# Altium project Flyback_lab_supply.PrjPcb
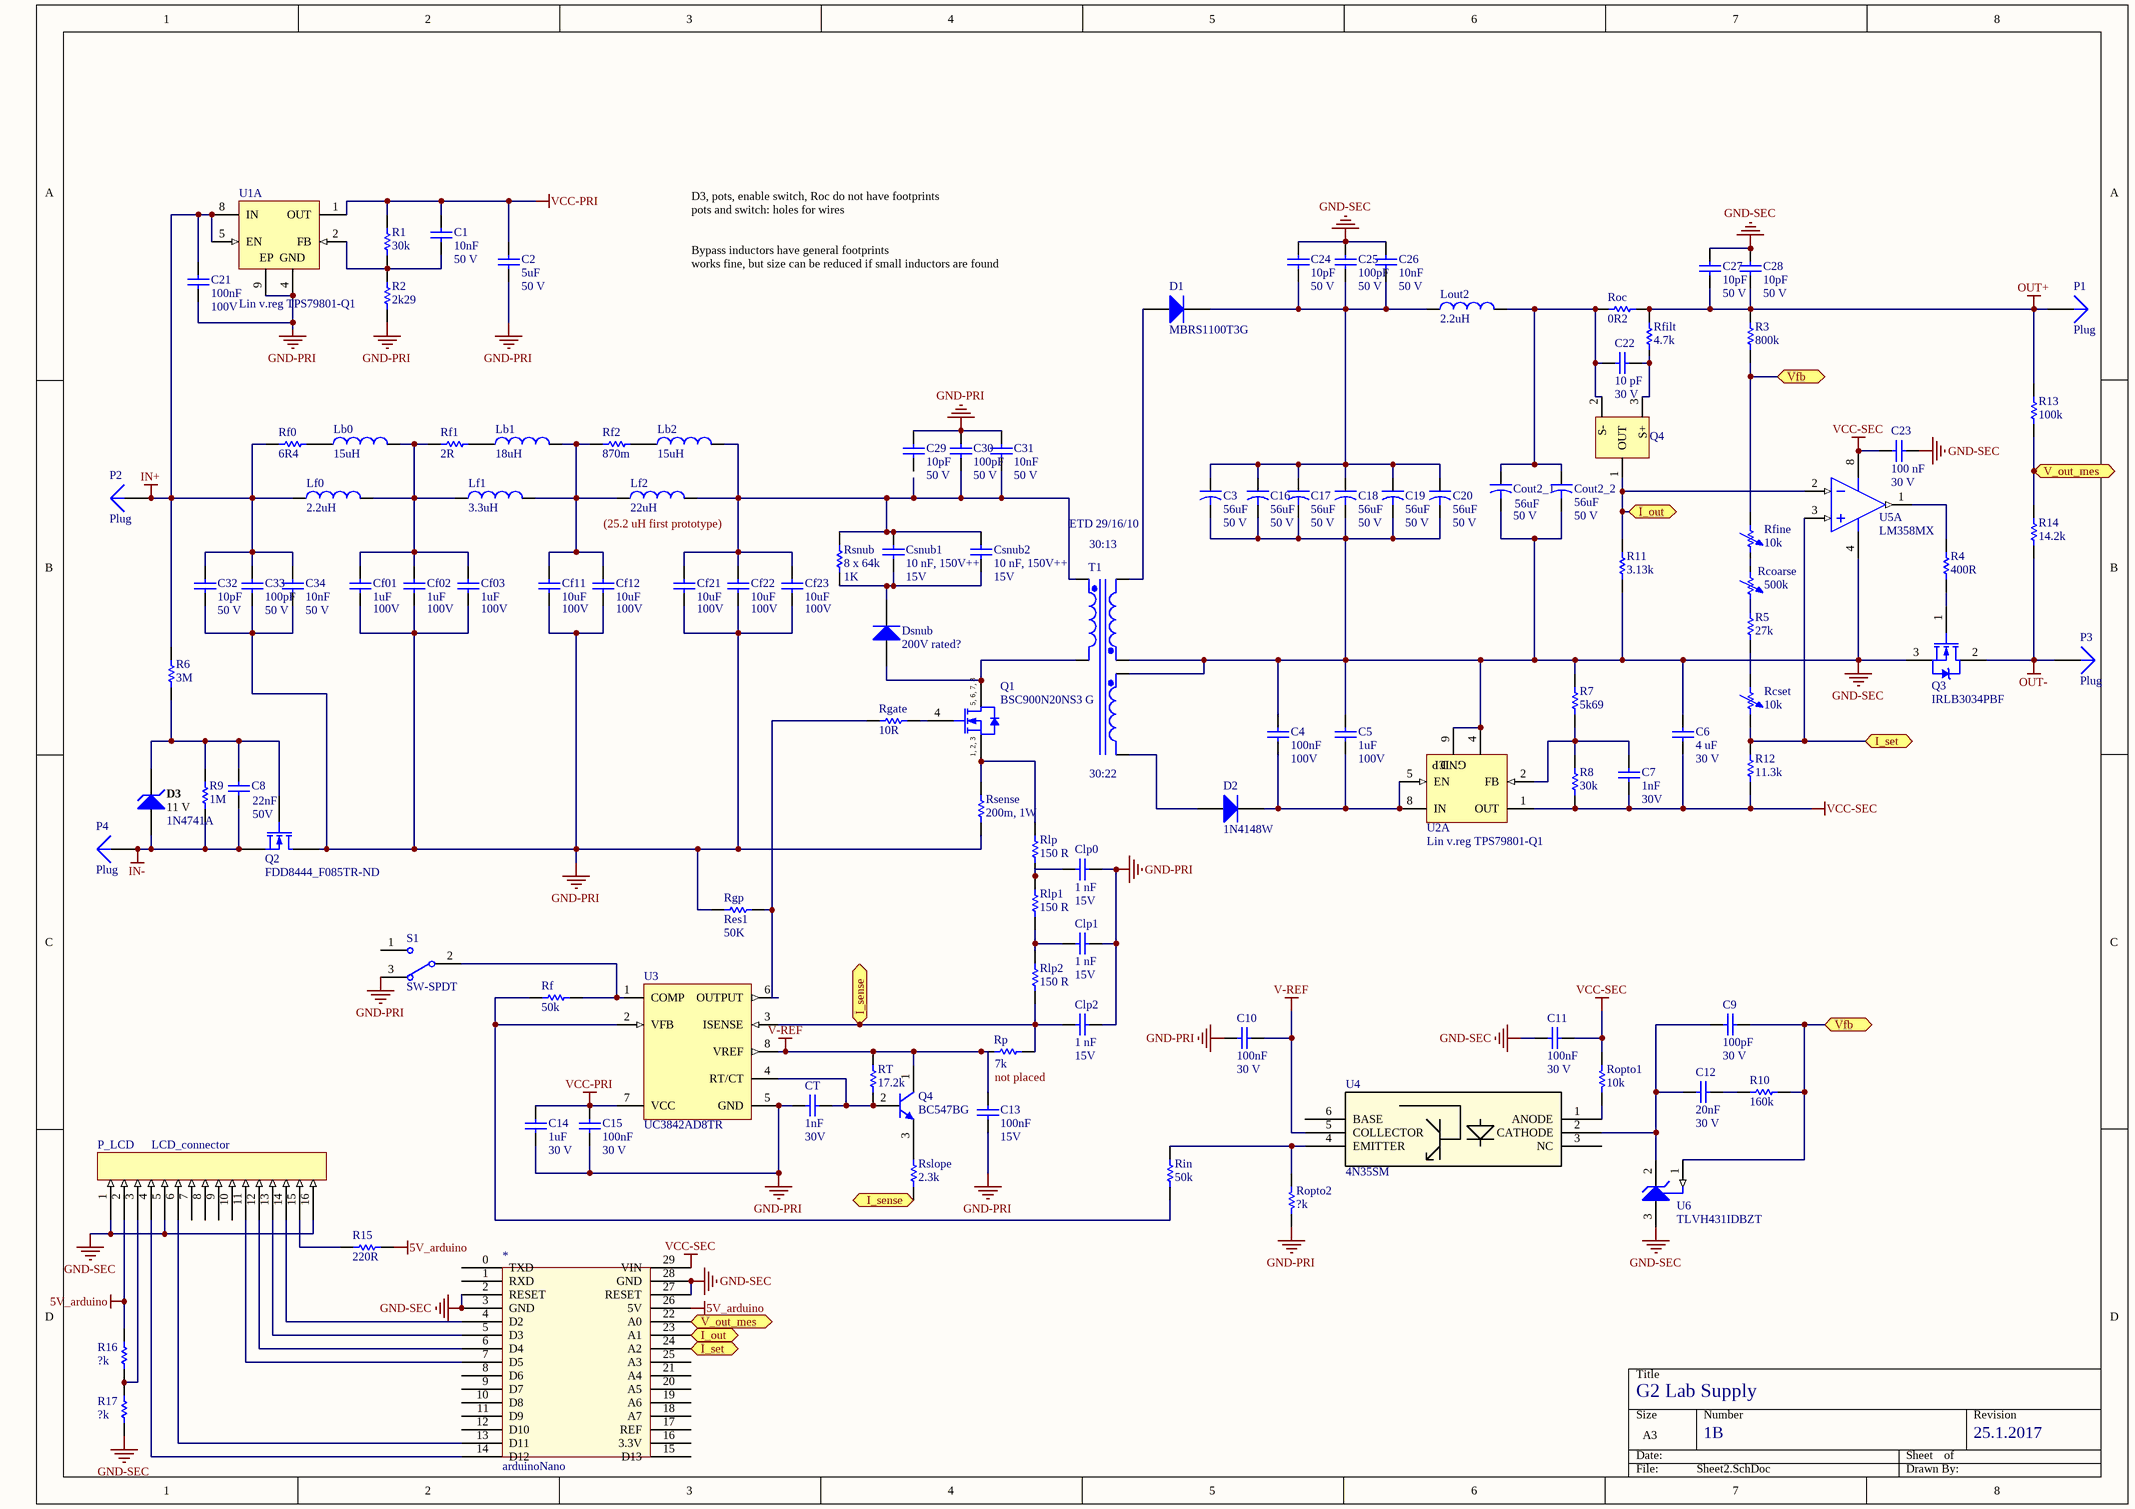
[diagram p0: Sheet2.SchDoc]
1 sheet, 119 parts. Net scope: flat (ports and power ports of the same name join across sheets).
Board file: PCB2.PcbDoc

## Sheet Sheet2.SchDoc: G2 Lab Supply
size A3; Revision: 1B

### Parts
(Parts that share a designator on the sheet are numbered #1, #2 ... from top to bottom, then left to right.)
*  arduinoNano  [Arduino nano]
C1  10nF  Rated Voltage: 50 V  [CAPC0805(2012)145_N]
C2  5uF  Rated Voltage: 50 V  [CAPC0805(2012)145_N]
C3  value 56uF  Voltage - Rated: 50 V  [Panasonic 56uF 50V EEU-FM1H560]  (hidden comment: Panasonic EEU-FM1H560)
C4  100nF  Rated Voltage: 100V  [CAPC0805(2012)145_N]
C5  1uF  Voltage - Rated: 100V  [CAPC3216X180X20LL20]
C6  4 uF  Rated Voltage: 30 V  [CAPC0805(2012)145_N]
C7  1nF  Rated Voltage: 30V  [CAPC0805(2012)145_N]
C8  22nF  Rated Voltage: 50V  [CAPC0805(2012)145_N]
C9  100pF  Rated Voltage: 30 V  [CAPC0805(2012)145_N]
C10  100nF  Rated Voltage: 30 V  [CAPC0805(2012)145_N]
C11  100nF  Rated Voltage: 30 V  [CAPC0805(2012)145_N]
C12  20nF  Rated Voltage: 30 V  [CAPC0805(2012)145_N]
C13  100nF  Rated Voltage: 15V  [CAPC0805(2012)145_N]
C14  1uF  Rated Voltage: 30 V  [CAPC0805(2012)145_N]
C15  100nF  Rated Voltage: 30 V  [CAPC0805(2012)145_N]
C16  value 56uF  Voltage - Rated: 50 V  [Panasonic 56uF 50V EEU-FM1H560]  (hidden comment: Panasonic EEU-FM1H560)
C17  value 56uF  Voltage - Rated: 50 V  [Panasonic 56uF 50V EEU-FM1H560]  (hidden comment: Panasonic EEU-FM1H560)
C18  value 56uF  Voltage - Rated: 50 V  [Panasonic 56uF 50V EEU-FM1H560]  (hidden comment: Panasonic EEU-FM1H560)
C19  value 56uF  Voltage - Rated: 50 V  [Panasonic 56uF 50V EEU-FM1H560]  (hidden comment: Panasonic EEU-FM1H560)
C20  value 56uF  Voltage - Rated: 50 V  [Panasonic 56uF 50V EEU-FM1H560]  (hidden comment: Panasonic EEU-FM1H560)
C21  100nF  Rated Voltage: 100V  [CAPC0805(2012)145_N]
C22  10 pF  Rated Voltage: 30 V  [CAPC0805(2012)145_N]
C23  100 nF  Rated Voltage: 30 V  [CAPC0805(2012)145_N]
C24  10pF  Rated Voltage: 50 V  [CAPC0805(2012)145_N]
C25  100pF  Rated Voltage: 50 V  [CAPC0805(2012)145_N]
C26  10nF  Rated Voltage: 50 V  [CAPC0805(2012)145_N]
C27  10pF  Rated Voltage: 50 V  [CAPC0805(2012)145_N]
C28  10pF  Rated Voltage: 50 V  [CAPC0805(2012)145_N]
C29  10pF  Rated Voltage: 50 V  [CAPC0805(2012)145_N]
C30  100pF  Rated Voltage: 50 V  [CAPC0805(2012)145_N]
C31  10nF  Rated Voltage: 50 V  [CAPC0805(2012)145_N]
C32  10pF  Rated Voltage: 50 V  [CAPC0805(2012)145_N]
C33  100pF  Rated Voltage: 50 V  [CAPC0805(2012)145_N]
C34  10nF  Rated Voltage: 50 V  [CAPC0805(2012)145_N]
Cf01  1uF  Voltage - Rated: 100V  [CAPC3216X180X20LL20]
Cf02  1uF  Voltage - Rated: 100V  [CAPC3216X180X20LL20]
Cf03  1uF  Voltage - Rated: 100V  [CAPC3216X180X20LL20]
Cf11  10uF  Voltage - Rated: 100V  [CAPC5750X250X20LL40]
Cf12  10uF  Voltage - Rated: 100V  [CAPC5750X250X20LL40]
Cf21  10uF  Voltage - Rated: 100V  [CAPC5750X250X20LL40]
Cf22  10uF  Voltage - Rated: 100V  [CAPC5750X250X20LL40]
Cf23  10uF  Voltage - Rated: 100V  [CAPC5750X250X20LL40]
Clp0  1 nF  Rated Voltage: 15V  [CAPC0805(2012)145_N]
Clp1  1 nF  Rated Voltage: 15V  [CAPC0805(2012)145_N]
Clp2  1 nF  Rated Voltage: 15V  [CAPC0805(2012)145_N]
Cout2_1  value 56uF  Voltage - Rated: 50 V  [Panasonic 56uF 50V EEU-FM1H560]  (hidden comment: Panasonic EEU-FM1H560)
Cout2_2  value 56uF  Voltage - Rated: 50 V  [Panasonic 56uF 50V EEU-FM1H560]  (hidden comment: Panasonic EEU-FM1H560)
Csnub1  10 nF, 150V++  Rated Voltage: 15V  [CAPC0805(2012)145_N]
Csnub2  10 nF, 150V++  Rated Voltage: 15V  [CAPC0805(2012)145_N]
CT  1nF  Rated Voltage: 30V  [CAPC0805(2012)145_N]
D1  MBRS1100T3G  [SMC]
D2  1N4148W  [JSCJ-SOD-123-2_V]
D3  11 V  PartNumber: 1N4741A  [FAIR-DO-41-2_V]
Dsnub  200V rated?  [SMC]
Lb0  15uH  [Lb low current inductor]
Lb1  18uH  [Lb low current inductor]
Lb2  15uH  [Lb low current inductor]
Lf0  2.2uH  [Wurth 744316220]
Lf1  3.3uH  [Wurth 7443340330]
Lf2  22uH  [Bourns PM5022S-220M-RC]
Lout2  2.2uH  [Wurth 744316220]
P1  Plug  [input output connector]
P2  Plug  [input output connector]
P3  Plug  [input output connector]
P4  Plug  [input output connector]
P_LCD  LCD_connector  [16-pin]
Q1  BSC900N20NS3 G  [INF-PG-TDSON-8-1_V]
Q2  FDD8444_F085TR-ND  [FDD8444]
Q3  IRLB3034PBF  [INF-PG-TO-220AB]
Q4#1  Current sense amplifier  [ZXCT1107S]  (value not drawn)
Q4#2  BC547BG  [ONSC-TO-92-3-29-11]
R1  30k  [RESC0805(2012)_L]
R2  2k29  [RESC0805(2012)_L]
R3  800k  [RESC0805(2012)_L]
R4  400R  [RESC0805(2012)_L]
R5  27k  [RESC0805(2012)_L]
R6  3M  [RESC0805(2012)_L]
R7  5k69  [RESC0805(2012)_L]
R8  30k  [RESC0805(2012)_L]
R9  1M  [RESC0805(2012)_L]
R10  160k  [RESC0805(2012)_L]
R11  3.13k  [RESC0805(2012)_L]
R12  11.3k  [RESC0805(2012)_L]
R13  100k  [RESC0805(2012)_L]
R14  14.2k  [RESC0805(2012)_L]
R15  value 220R  [RESC0805(2012)_L]
R16  value ?k  [RESC0805(2012)_L]
R17  value ?k  [RESC0805(2012)_L]
Rcoarse  500k  [AXIAL-0.7]
Rcset  10k  [AXIAL-0.7]
Rf  50k  [RESC0805(2012)_L]
Rf0  6R4  [RESC0805(2012)_L]
Rf1  2R  [RESC0805(2012)_L]
Rf2  870m  [RESC0805(2012)_L]
Rfilt  4.7k  [RESC0805(2012)_L]
Rfine  10k  [AXIAL-0.7]
Rgate  10R  [RESC0805(2012)_L]
Rgp  Res1  value 50K  [6-0805_L]
Rin  50k  [RESC0805(2012)_L]
Rlp  150 R  [RESC0805(2012)_L]
Rlp1  150 R  [RESC0805(2012)_L]
Rlp2  150 R  [RESC0805(2012)_L]
Roc  0R2  [RESC0805(2012)_L]
Ropto1  10k  [RESC0805(2012)_L]
Ropto2  ?k  [RESC0805(2012)_L]
Rp  not placed  value 7k  [RESC0805(2012)_L]
Rsense  200m, 1W  [RESC2512(6432)_M]
Rslope  value 2.3k  [RESC0805(2012)_L]
Rsnub  8 x 64k  value 1K  [Resistor snubber]
RT  17.2k  [RESC0805(2012)_L]
S1  SW-SPDT  [TL36WW15050]
T1  ETD 29/16/10, Turns ratio 30:13:22  [ETD 29/16/10 v2]  (value not drawn)
U1  Lin v.reg TPS79801-Q1  [DGN0008B_N]  (part A of 2)
U2  Lin v.reg TPS79801-Q1  [DGN0008B_N]  (part A of 2)
U3  UC3842AD8TR  [D0008A_L]
U4  4N35SM  [4N35SM (RS 917-5447)]
U5  LM358MX  [D0008A_M]  (part A of 2)
U6  TLVH431IDBZT  [TI-DBZ3_N]

### Ports
I_out, I_sense, I_set, V_out_mes, Vfb

### Nets
5V_arduino: *.26(5V) P_LCD.2 R15.1 R16.2
GND-PRI: C2.1 C10.1 C13.2 C14.1 C15.1 C21.1 C29.2 C30.2 C31.2 C32.1 C33.1 C34.1 Cf01.1 Cf02.1 Cf03.1 Cf11.1 Cf12.1 Cf21.1 Cf22.1 Cf23.1 Clp0.2 Clp1.2 Clp2.2 CT.2 Q2.1(D) R2.1 Rgp.2 Ropto2.1 Rsense.1 S1.3 U1.4(GND) U1.9(EP) U3.5(GND)
GND-SEC: *.2(RESET) *.3(GND) *.27(RESET) *.28(GND) C3.2 C4.2 C5.2 C6.2 C11.1 C16.2 C17.2 C18.2 C19.2 C20.2 C23.1 C24.2 C25.2 C26.2 C27.2 C28.2 Cout2_1.2 Cout2_2.2 P_LCD.1 P_LCD.5 P_LCD.16 Q3.3(S) R7.1 R11.1 R17.1 T1.3(Sec1+) T1.5(Sec2+) U2.4(GND) U2.9(EP) U5.4(GND) U6.3(ANODE)
IN+: C21.2 C32.2 C33.2 C34.2 Lf0.1 P2.1 R6.2 Rf0.2 U1.5(EN) U1.8(IN)
IN-: C8.1 D3.1(A) P4.1 Q2.3(S) R9.1
OUT+: C27.1 C28.1 P1.1 R3.2 R13.2 Rfilt.2 Roc.2
OUT-: P3.1 Q3.2(D) R14.1
V-REF: C10.2 C13.1 Q4#2.1(C) Rp.1 RT.2 U3.8(VREF) U4.5(COLLECTOR)
VCC-PRI: C1.2 C2.2 C14.2 C15.2 R1.2 U1.1(OUT) U3.7(VCC)
VCC-SEC: *.29(VIN) C6.1 C7.1 C11.2 C23.2 R8.2 R12.2 Ropto1.1 U2.1(OUT) U5.8(V+)
Net*_4: *.4(D2) P_LCD.14
Net*_5: *.5(D3) P_LCD.13
Net*_6: *.6(D4) P_LCD.12
Net*_7: *.7(D5) P_LCD.11
Net*_13: *.13(D11) P_LCD.6
Net*_14: *.14(D12) P_LCD.4
Net*_22: *.22(A0) R13.1 R14.2 ; port V_out_mes
Net*_23: *.23(A1) Q4#1.1(OUT) R11.2 U5.2(INA-) ; port I_out
Net*_24: *.24(A2) R12.1 Rcset.2 U5.3(INA+) ; port I_set
NetC1_1: C1.1 R1.1 R2.2 U1.2(FB)
NetC3_1: C3.1 C16.1 C17.1 C18.1 C19.1 C20.1 C24.1 C25.1 C26.1 D1.2(K) Lout2.1
NetC4_1: C4.1 C5.1 D2.2(-) U2.5(EN) U2.8(IN)
NetC7_2: C7.2 R7.2 R8.1 U2.2(FB)
NetC8_2: C8.2 D3.2(K) Q2.2(G) R6.1 R9.2
NetC9_1: C9.1 C12.1 U4.2(CATHODE) U6.2(CATHODE)
NetC9_2: C9.2 R3.1 R10.1 Rfine.1 U6.1(REF) ; port Vfb
NetC12_2: C12.2 R10.2
NetC22_1: C22.1 Q4#1.3(S+) Rfilt.1
NetC22_2: C22.2 Cout2_1.1 Cout2_2.1 Lout2.2 Q4#1.2(S-) Roc.1
NetC30_1: C30.1 C31.1 Cf21.2 Cf22.2 Cf23.2 Csnub1.2 Csnub2.2 Lb2.2 Lf2.2 Rsnub.2 T1.1(Pri+)
NetCf01_2: Cf01.2 Cf02.2 Cf03.2 Lb0.2 Lf0.2 Lf1.1 Rf1.2
NetCf11_2: Cf11.2 Cf12.2 Lb1.2 Lf1.2 Lf2.1 Rf2.2
NetClp0_1: Clp0.1 Rlp.2 Rlp1.1
NetClp1_1: Clp1.1 Rlp1.2 Rlp2.1
NetClp2_1: Clp2.1 Rlp2.2 Rp.2 Rslope.1 U3.3(ISENSE) ; port I_sense
NetCsnub1_1: Csnub1.1 Csnub2.1 Dsnub.2(K) Rsnub.1
NetCT_1: CT.1 Q4#2.2(B) RT.1 U3.4(RT/CT)
NetD1_1: D1.1(A) T1.4(Sec1-)
NetD2_1: D2.1(+) T1.6(Sec2-)
NetDsnub_1: Dsnub.1(A) Q1.5(DRAIN) Q1.6(DRAIN) Q1.7(DRAIN) Q1.8(DRAIN) T1.2(Pri-)
NetLb0_1: Lb0.1 Rf0.1
NetLb1_1: Lb1.1 Rf1.1
NetLb2_1: Lb2.1 Rf2.1
NetP_LCD_3: P_LCD.3 R16.1 R17.2
NetP_LCD_15: P_LCD.15 R15.2
NetQ1_1: Q1.1(SOURCE) Q1.2(SOURCE) Q1.3(SOURCE) Rlp.1 Rsense.2
NetQ1_4: Q1.4(GATE) Rgate.1
NetQ3_1: Q3.1(G) R4.1
NetQ4#2_3: Q4#2.3(E) Rslope.2
NetR4_2: R4.2 U5.1(OUTA)
NetR5_1: R5.1 Rcset.1
NetR5_2: R5.2 Rcoarse.2
NetRcoarse_1: Rcoarse.1 Rfine.2
NetRf_1: Rf.1 S1.2 U3.1(COMP)
NetRf_2: Rf.2 Rin.2 U3.2(VFB)
NetRgate_2: Rgate.2 Rgp.1 U3.6(OUTPUT)
NetRin_1: Rin.1 Ropto2.2 U4.4(EMITTER)
NetRopto1_2: Ropto1.2 U4.1(ANODE)

Not connected (* = marked no-connect by the designer): * 0(TXD) 1(RXD) 8(D6) 9(D7) 10(D8) 11(D9) 12(D10) 15(D13) 16(3.3V) 17(REF) 18(A7) 19(A6) 20(A5) 21(A4) 25(A3); C29 1; P_LCD 7 8 9 10; S1 1; U4 3(NC) 6(BASE)

### Notes on the sheet
- D3, pots, enable switch, Roc do not have footprints
  pots and switch: holes for wires
  Bypass inductors have general footprints
  works fine, but size can be reduced if small inductors are found
- (near Lf2) (25.2 uH first prototype)
- ETD 29/16/10
- (near T1) 30:13
- (near T1) 30:22
- 25.1.2017
- (in symbol CMP-1091-00024-1) 5, 6, 7, 8; 1, 2, 3

### Library data of the parts
C1 C2 C6-C15 C22-C34 Clp0-Clp2 Csnub1 Csnub2 CT = CMP-1036-04379-1: CAP 82nF; Case-EIA: 0805; Case-Metric: 2012; Tolerance: Â±10%; Value: 82nF; Technology: SMT; Max Thickness: 1.45 mm
C3 = Cap2: Published: 23-Sep-2002; PackageReference: CAPR5-4X5; Publisher: Altium Limited; PackageDescription: Capacitor; 2 Leads
C4 C21 = CMP-1036-04379-1: footprint not correct; Value: 82nF; Case-EIA: 0805; Case-Metric: 2012; Tolerance: Â±10%; Technology: SMT; Max Thickness: 1.45 mm
C5 Cf01 Cf02 Cf03 = CMP-2000-06049-1: Chip Capacitor, 1 uF, +/- 10%, 100 V, -55 to 125 degC, 1206 (3216 Metric), RoHS, Tape and Reel; Manufacturer: TDK; PCN Part Number: MLCCPartNumberChange30/Nov/2012; Kits: SAMPLEKIT1008-ND-KITCAPCERMLCC100V-630V; Product Training Modules: SEAT,CCV,andTVCLDesignToolsGuidetoReplacinganElectrolyticCapacitorwithanMLCC; Capacitance: 1µF; Featured Product: C-SeriesMidVoltageMLCCs; Other Names: 445-4467-1; Catalog Drawings: CSERIES_1206_1.8; Online Catalog: CSeries,MidVoltage; Temperature Coefficient: X7R; Features: -; Family: CeramicCapacitors; Datasheet URL: http://www.farnell.com/datasheets/1484596.pdf; Mounting Technology: SurfaceMount; Mounting Type: SurfaceMount,MLCC; Datasheet Version: 08/2011; Standard Package: 1; Package / Case: 1206(3216Metric); Applications: GeneralPurpose; Package Reference: 1206; Operating Temperature: -55°C~125°C; Packaging: CutTape(CT); Package Description: 2-Pin Surface Mount Device, Body 3.2 x 1.6 mm; Ratings: -; Series: C; Tolerance: ±10%; Manufacturer URL: http://www.tdk.com/; Lead Spacing: -; Height - Seated (Max): -; Package URL: https://product.tdk.com/info/en/documents/chara_sheet/C3216X7R1V106K160AC.pdf; Lead Style: -; Category: Capacitors; RoHS Information: RoHSCertificate-MLCC
C16-C20 Cout2_1 Cout2_2 = Cap2: Capacitor; Published: 23-Sep-2002; PackageReference: CAPR5-4X5; Publisher: Altium Limited; PackageDescription: Capacitor; 2 Leads
Cf11 Cf12 Cf21-Cf23 = CMP-2000-07445-1: Chip Capacitor, 10 uF, +/- 10%, 100 V, -55 to 125 degC, 2220 (5750 Metric), RoHS, Tape and Reel; Manufacturer: TDK; Package Description: 2-Pin Surface Mount Device, Body 5.7 x 5 mm; Package Reference: 2220; Mounting Technology: SurfaceMount; Datasheet URL: https://product.tdk.com/info/en/catalog/datasheets/mlcc_automotive_midvoltage_en.pdf; Datasheet Version: 03/2015; Manufacturer URL: http://www.tdk.com/
D1 Dsnub = Diode: Default Diode; Published: 8-Jun-2000; LatestRevisionDate: 17-Jul-2002; LatestRevisionNote: Re-released for DXP Platform.; PackageVersion: Sep-1996; PackageReference: SMC; Publisher: Altium Limited; PackageDescription: DO-214-AB/SMC; 2 C-Bend Leads; Body 7.9 x 5.9 mm, inc. leads (LxW); Code_JEDEC: DO-214-AB
D2 = CMP-0914-00001-1: Fast Switching Diode, 75 V, 150 mA, 2-Pin 2.7 x 1.6 x 1.25 mm SMD, Tape and Reel; Manufacturer: Changjiang Electronics; TSTG (degC): -55 to 150; IR (uA): 1; VR (V): 75; VF (V): 1.25; PD (mW): 350; Trr (ns): 4; IO (mA): 150; Packing: Tape and Reel; ComponentLink2URL: http://www.cj-elec.com/txUpfile/20121613352740313.pdf; PackageReference: SOD-123-2; PackageVersion: Rev. A; DatasheetVersion: Rev. A; ComponentLink3Description: Package Specification; ComponentLink3URL: http://www.cj-elec.com/txUpfile/201412112231195145.pdf; ComponentLink1Description: Manufacturer URL; ComponentLink1URL: http://www.cj-elec.com/; PartNumber: 1N4148W; ComponentLink2Description: Datasheet; PackageDescription: 2-Pin SMD, Body 2.7 x 1.6 mm, Height 1.25 mm; Mounting Technology: Surface Mount
D3 = CMP-0892-00002-1: Zener Diode, 11V, 1W, 5%, -65 to 200 degC, 2-Pin DO-41, Body 2.72 x 5.2 mm, RoHS; Manufacturer: Fairchild Semiconductor; PD (W): 1; VZ (Min.) (V): 10.45; VZ (Max.) (V): 11.55; Test Current IZ (mA): 23; ZZ (Max) (ohm): 7; IR (uA): 5; ComponentLink3URL: http://www.fairchildsemi.com/dwg/DO/DO41A.pdf; ComponentLink2Description: Datasheet; ComponentLink3Description: Package Specification; ComponentLink2URL: http://www.fairchildsemi.com/ds/1N/1N4744A.pdf; PackageVersion: Rev. 2; RoHS: TRUE; DatasheetVersion: Rev. H3; Mounting Technology: Through Hole; Operating and Storage Temperature Range: -65 to 200 degC; PackageReference: DO-41-2; ComponentLink1URL: http://www.fairchildsemi.com/; ComponentLink1Description: Manufacturer URL; Tolerance: 5%; PackageDescription: 2-Pin Axial leaded, Body 2.72 x 5.2 mm, Lead Spread 25.4 mm
Lb0-Lb2 Lf0-Lf2 Lout2 = Inductor: Code_IEC: 1005; Value: 10mH; Published: 8-Jun-2000; LatestRevisionDate: 29-May-2009; LatestRevisionNote: IPC-7351 Footprint Added.; PackageReference: 0402-A; Publisher: Altium Limited; PackageDescription: Chip Inductor; Code_JEITA: 0402
P_LCD = 16 pin connector: Published: 8-Jun-2000; LatestRevisionDate: 29-May-2009; LatestRevisionNote: Sch pins A & K swapped.; DatasheetVersion: E2732B; PackageReference: D-38; Publisher: Altium Limited; PackageDescription: Bridge Rectifier; 4 Terminals; Body 9.4 x 9.4 mm (typ); Pitch 5.08 mm
Q1 = CMP-1091-00024-1: N-Channel OptiMOS 3 Power-Transistor, 200 V VDS, 15.2 A ID, -55 to 150 degC, PG-TDSON-8-1, Reel, Green; Manufacturer: Infineon; RDS (on) (max): 90Â mOhm; RthJC (max): 2Â K/W; Green: TRUE; IDpuls (max): 61Â A; VGS(th) (min): 2Â V; RthJA (max): 50 K/W; Polarity: N; QG: 9Â nC; VGS(th) (max): 4Â V; VDS (max): 200Â V; ID (max): 15.2Â A; Ptot (max): 62.5Â W; PackageReference: PG-TDSON-8-1; PackageDescription: 8-Pin Plastic (Green) Thin Dual Small Outline Non-Leaded Package, 5.15 x 5.9 mm Body, 1.27 mm Pitch; ComponentLink2Description: Datasheet; ComponentLink3URL: http://www.infineon.com/cms/packages/SMD_-_Surface_Mounted_Devices/P-PG-TDSON/P-PG-TDSON-08-01x_2x_3.html?__locale=en; ComponentLink1URL: http://www.infineon.com/; PartNumber: BSC900N20NS3 G; Packing: Reel; DatasheetVersion: Rev. 2.2; Mounting Technology: Surface Mount; ComponentLink3Description: Package Specification; ComponentLink2URL: http://www.infineon.com/dgdl/BSC900N20NS3+Rev2.2.pdf?folderId=db3a304325305e6d012596c6ca7b290a&fileId=db3a30432ad629a6012b144f6b0619db; Rth: 2Â K/W; ComponentLink1Description: Manufacturer URL; Halogen-free: TRUE
Q2 = MOSFET-N: Published: 8-Jun-2000; LatestRevisionDate: 17-Jul-2002; LatestRevisionNote: Re-released for DXP Platform.; PackageVersion: 1995/1996; PackageReference: E3; Publisher: Altium Limited; PackageDescription: TO, Flat Index; 3 In-Line, Axial Leads; Body Dia. 4.6mm; Lead Dia. 0.5 mm (max)
Q3 = CMP-2000-04998-1: Mosfet N-Channel, 40 V, 195 A, -55 to 175 degC, 3-Pin TO-220AB, RoHS, Tube; Manufacturer: International Rectifier; Typical TurnOff Delay Time: 97ns; Configuration: Single; Maximum Continuous Drain Current: 343A; Typical Input Capacitance @ Vds: 10315pF@25V; Maximum Power Dissipation: 375W; Maximum Gate Source Voltage: ±20V; Forward Diode Voltage: 1.3V; Maximum Drain Source Voltage: 40V; Typical Turn On Delay Time: 65ns; Maximum Drain Source Resistance: 2mΩ; Package Version: Feb-04; Channel Type: N; Channel Mode: Enhancement; Typical Gate Charge @ Vgs: 54nC@4.5V; Number of Elements per Chip: 1; Forward Transconductance: 286S; Datasheet URL: https://datasheet.ciiva.com/26325/161162-da-01-en-mosfet-irlb3034pbf-to220ab-ir-26325354.pdf; Series: HEXFETSeries; Datasheet Version: Jan-09; Pin Count: 3; Manufacturer URL: http://internationalrectifier.com/; Maximum Operating Temperature: +175degC; Operating Temperature Range: -55to+175degC; Height: 15.24mm; Mounting Type: ThroughHole; Dimensions: 10.54x4.69x15.24mm; Package Reference: PG-TO-220AB; Package Description: 3-Pin Plastic (Green) Transistor Single Outline Package, 9.9 x 9.2 mm Body, 2.54 mm Pitch; Category: PowerMOSFET; Length: 10.54mm; Package URL: http://www.infineon.com/dgdl/bts110.pdf?folderId=db3a304412b407950112b43583c16310&fileId=db3a304412b407950112b43584326311&sId=db3a30443e3c704d013e4eb6657a2604; Package Type: TO-220AB; Width: 4.69mm; Minimum Operating Temperature: -55degC
Q4#1 = ZXCT1107S
Q4#2 = CMP-1048-01469-1: Amplifier Transistor, NPN Silicon, 3-Pin TO-92, Pb-Free, Bulk Box; Manufacturer: On Semiconductor; IC Continuous (A): 0.1; fT Min (MHz): 150; Packing: Bulk Box; RoHS: TRUE; PackageVersion: Rev. AM; Mounting Technology: Through Hole; Polarity: NPN; PackageReference: TO-92-3-29-11_AM_SL; DatasheetVersion: Rev. 7; ComponentLink2URL: http://www.onsemi.com/pub_link/Collateral/BC546-D.PDF; ComponentLink1Description: Manufacturer URL; ComponentLink3URL: http://www.onsemi.cn/pub_link/Collateral/2N6426-D.PDF; PackageDescription: 3-Pin Transistor Outline, Body 4.825 x 3.685 mm, Pitch 1.27 mm; ComponentLink2Description: Datasheet; ComponentLink1URL: http://www.onsemi.com/; PartNumber: BC547BG; ComponentLink3Description: Package Specification
R1-R10 R12-R14 Rf Rf1 Rf2 Rfilt Rgate Rin Rlp Rlp1 Rlp2 Roc Ropto1 Ropto2 RT = CMP-1013-00736-1: Value: 100000.00 Ohm; Tolerance: 1 %; Case-Metric: 2012; Power: 0.125 W; Case-EIA: 0805; Technology: SMT
R11 = CMP-1013-00736-1: adjusted to keep current mes. IC at low enough voltage; Value: 100000.00 Ohm; Tolerance: 1 %; Case-Metric: 2012; Power: 0.125 W; Case-EIA: 0805; Technology: SMT
R15-R17 = CMP-1013-00736-1: Tolerance: 1 %; Case-Metric: 2012; Power: 0.125 W; Case-EIA: 0805; Technology: SMT
Rcoarse Rcset Rfine = Res Adj1: Variable Resistor; Value: 50K; Set Position: 0.5; Published: 8-Jun-2000; LatestRevisionDate: 17-Jul-2002; LatestRevisionNote: Re-released for DXP Platform.; PackageReference: AXIAL-0.7; Publisher: Altium Limited; PackageDescription: Axial Device, Thru-Hole; 2 Leads; 0.7 in Pin Spacing
Rf0 = CMP-1013-00736-1: Value: 6.4 Ohm; Tolerance: 1 %; Case-Metric: 2012; Power: 0.125 W; Case-EIA: 0805; Technology: SMT
Rgp = Res1: Resistor; Published: 8-Jun-2000; LatestRevisionDate: 17-Jul-2002; LatestRevisionNote: Re-released for DXP Platform.; PackageReference: AXIAL-0.3; Publisher: Altium Limited; PackageDescription: Axial Device, Thru-Hole; 2 Leads; 0.3 in Pin Spacing
Rp Rslope = CMP-1013-00736-1: Biasing current sense; Tolerance: 1 %; Case-Metric: 2012; Power: 0.125 W; Case-EIA: 0805; Technology: SMT
Rsense = CMP-1018-00736-1: 2512 (6432 Metric)  SMD; Case-Metric: 6432; Case-EIA: 2512; Tolerance: 1 %; Power: 1 W; Technology: SMT
Rsnub = Res1: parallel; Published: 8-Jun-2000; LatestRevisionDate: 17-Jul-2002; LatestRevisionNote: Re-released for DXP Platform.; PackageReference: AXIAL-0.3; Publisher: Altium Limited; PackageDescription: Axial Device, Thru-Hole; 2 Leads; 0.3 in Pin Spacing
S1 = SW-SPDT: SPDT Subminiature Toggle Switch, Right Angle Mounting, Vertical Actuation; Published: 24-Mar-1999; LatestRevisionDate: 17-Dec-2003; LatestRevisionNote: Schematic revised, PCB Footprint replaced.; DatasheetVersion: 05-Dec-2000; PackageReference: TL36WW15050; Publisher: Altium Limited; PackageDescription: Switch; 4 Leads; ComponentLink1Description: Manufacturer Link; ComponentLink1URL: http://www.apem.com
T1 = Trans3: Three-winding Transformer (Non-Ideal)
U1 U2 = CMP-0394-01260-2: got this footprint from a similar model; Manufacturer: Texas Instruments; PartNumber: TPS79801QDGNRQ1; Iq(Typ)(mA): 0.04; Vout Adj(Min)(V): 1.275; Iout(Max)(A): 0.05; Vout Adj(Max)(V): 28; Vdo(Typ)(mV): 300; Vin(Max)(V): 50; Eco-Plan: Green (RoHS & no Sb/Br); SubFamily: Single Channel LDO; Vin(Min)(V): 3; Accuracy(%): 1.5; ComponentLink2URL: http://www.ti.com/general/docs/lit/getliterature.tsp?genericPartNumber=TPS79801-Q1&fileType=pdf; Code_JEDEC: MO-187; ComponentLink2Description: Datasheet; PackageDescription: 8-Pin Plastic Small Outline, Body 3 x 3 mm, Pitch 0.65 mm; ComponentLink1URL: http://www.ti.com/; PackageVersion: 4073271/F; Mounting Technology: Surface Mount; ComponentLink1Description: Manufacturer URL; DatasheetVersion: SLVS822D; ComponentLink3URL: http://www.ti.com/litv/pdf/mpds046e; PackageReference: DGN0008B; ComponentLink3Description: Package Specification
U3 = CMP-0319-00555-2: PWM Controller with Current Control, 100 % Duty Cycle, 0 to +70 degC, 8-pin SOIC (D), Green (RoHS & no Sb/Br); Manufacturer: Texas Instruments; Rating: Catalog; Topology: Boost, Buck, Flyback, Forward; Regulated Outputs(#): 1; Duty Cycle(Max)(%): 100; UVLO Thresholds On/Off(V): 16/10; Frequency(Max)(kHz): 450; ComponentLink1Description: Datasheet; ComponentLink1URL: http://www.ti.com/general/docs/lit/getliterature.tsp?genericPartNumber=UC3842A&fileType=pdf; Mounting Technology: Surface Mount; PartNumber: UC3842AD8TR; Control Method: Current; PackageDescription: 8-Pin Plastic Small Outline Integrated Circuit, 4.9 x 3.9 mm, Pitch 1.27 mm Pitch; DatasheetVersion: SLUS224C; PackageVersion: revM, Jun-2011; Code_JEDEC: MS-012AA; PackageReference: D0008A; Eco-Plan: Green (RoHS & no Sb/Br); SubFamily: PWM Controller
U4 = 4N35(SHORT): Built_By: EMA_UL_Team; C: Copyright (C) 2015 Accelerated Designs. All rights reserved; Manufacturer_Part_Number: 4N35SM; Value: Value; Type: Type; RefDes: RefDes
U5 = CMP-0055-00630-3: Low Power Dual Operational Amplifier, 8-pin Narrow SOIC; Manufacturer: Texas Instruments; PowerWise: N; PackageTopMarking: NSZXTT*LM*358M; CompType: Amplifiers; ComponentLink1URL: http://www.ti.com/general/docs/lit/getliterature.tsp?genericPartNumber=LM358-N&fileType=pdf; PinCount: 8; PackageDescription: SOIC Narrow, 4.9 x 3.9 x 1.45mm, 8 Lead, 1.27mm Pitch; Code_IPC: SOIC127P600-8; RoHS: N; Code_JEDEC: MS-012-AA; Package Reference: D0008A; ComponentLink1Description: Datasheet URL; PartId: 1
U6 = CMP-0366-00941-1: Low-Voltage Adjustable Precision Shunt Regulator, 80 mA, -40 to 85 degC, 3-pin SOT-23 (DBZ), Green (RoHS & no Sb/Br); Manufacturer: Texas Instruments; SubFamily: Shunt Voltage Reference; VO Adj(Max)(V): 18; Temp Coeff(Max)(ppm/ degree C): 129; Rating: Catalog; Initial Accuracy @ 25/deg C(%): 1.5; Min Iz for Regulation(uA): 80; VO Adj(Min)(V): 1.24; PackageDescription: 3-Pin Plastic Small Outline, Body 2.92 x 1.3 mm, Pitch 0.95 mm; ComponentLink1Description: Manufacturer URL; Mounting Technology: Surface Mount; PartNumber: TLVH431IDBZT; PackageVersion: 4203227/B; Code_JEDEC: TO-236; ComponentLink1URL: http://www.ti.com/; ComponentLink2URL: http://www.ti.com/general/docs/lit/getliterature.tsp?genericPartNumber=TLVH431&fileType=pdf; DatasheetVersion: SLVS555I; PackageReference: DBZ3; Iout/Iz(Max)(mA): 80; ComponentLink3Description: Package Specification; Eco-Plan: Green (RoHS & no Sb/Br); ComponentLink3URL: http://www.ti.com/litv/pdf/mpds108a; ComponentLink2Description: Datasheet
P1-P4 = Plug: LatestRevisionDate: 17-Jul-2002; LatestRevisionNote: Re-released for DXP Platform.; Publisher: Altium Limited